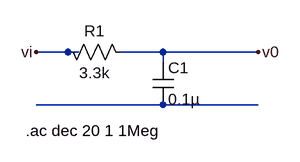
[diagram p0: schematic Draft1.asc]
Draft1.asc, the LTspice schematic file:
Version 4
SHEET 1 880 680
WIRE 48 -688 0 -688
WIRE 64 -688 48 -688
WIRE 192 -688 128 -688
WIRE 336 -688 192 -688
WIRE 192 -672 192 -688
WIRE 192 -608 0 -608
WIRE 336 -608 192 -608
FLAG 0 -688 vi
FLAG 336 -688 v0
SYMBOL res 32 -704 M90
WINDOW 0 0 56 VBottom 2
WINDOW 3 32 56 VTop 2
SYMATTR InstName R1
SYMATTR Value 3.3k
SYMBOL cap 176 -672 R0
SYMATTR InstName C1
SYMATTR Value 0.1µ
TEXT -16 -568 Left 2 !.ac dec 20 1 1Meg

The netlist it stands for:
* Draft1.asc
R1 vi v0 3.3k
C1 v0 N001 0.1µ
.ac dec 20 1 1Meg
.backanno
.end